# EAGLE design 100tqfpBreakout (EAGLE 6.6.0)
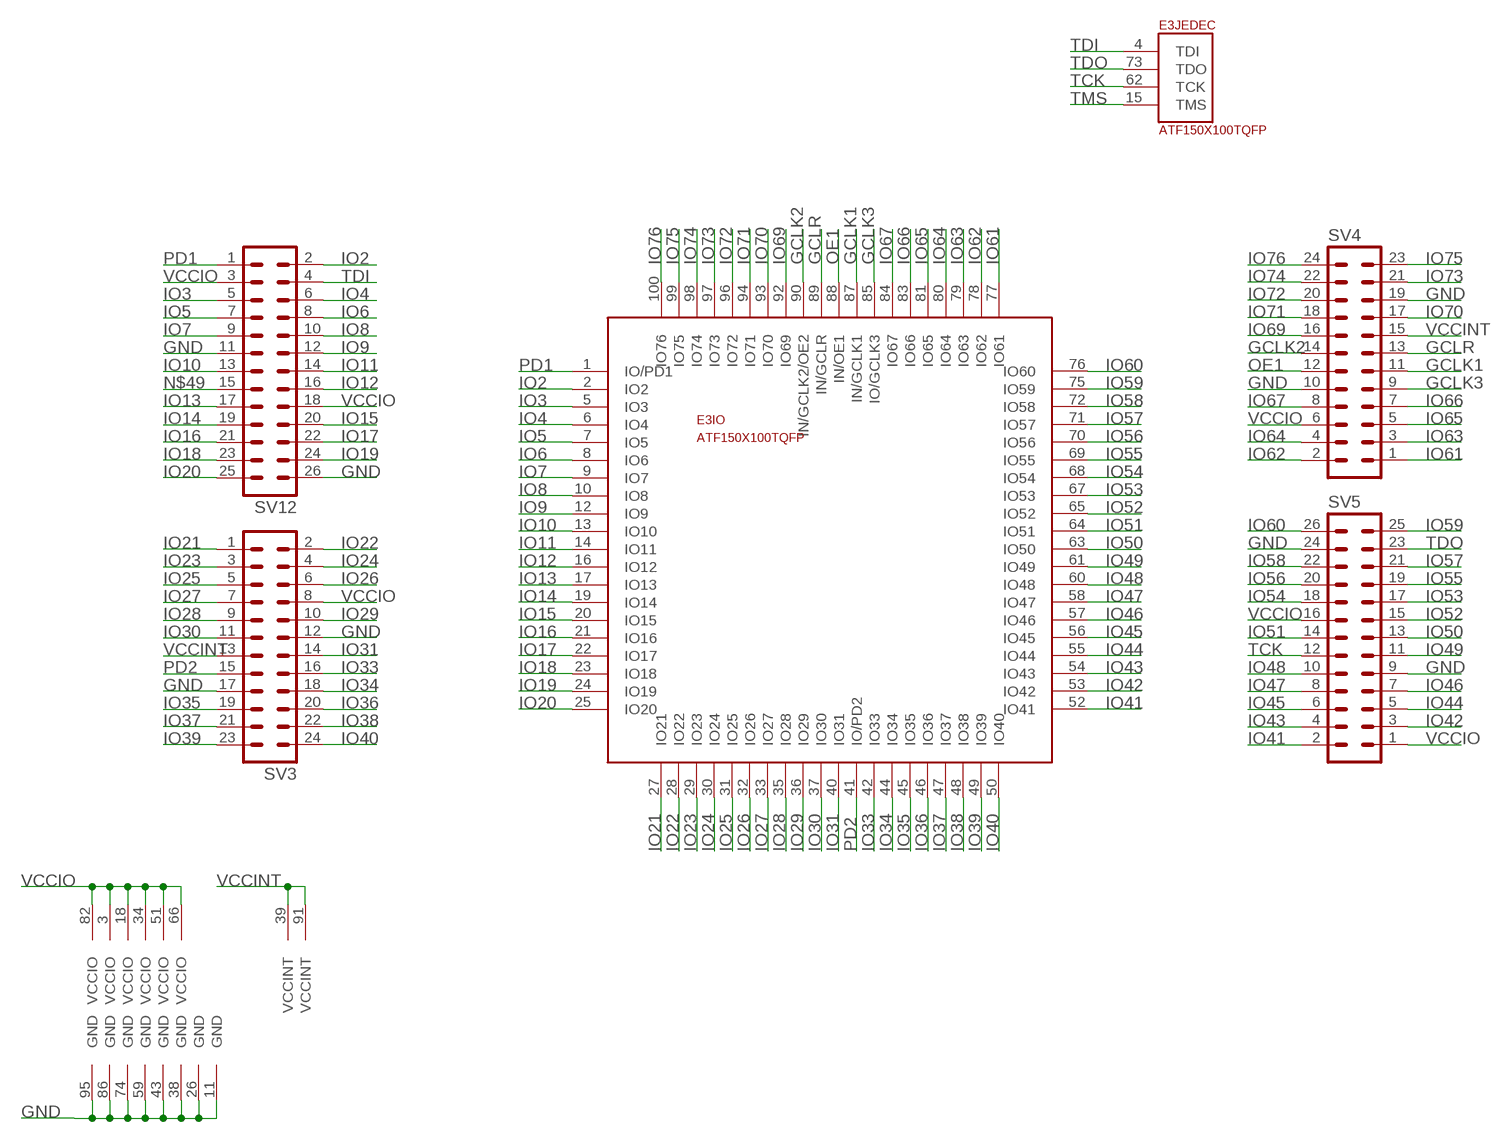
[diagram p0: schematic, sheet 1]

## Parts
E3  ATF150X100TQFP  [TQFP-100]
SV3  MA12-2  [MA12-2]
SV4  MA12-2  [MA12-2]
SV5  MA13-2  [MA13-2]
SV12  MA13-2  [MA13-2]

## Nets
GCLK1: E3.87(IO:IN/GCLK1) SV4.11
GCLK2: E3.90(IO:IN/GCLK2/OE2) SV4.14
GCLK3: E3.85(IO:IO/GCLK3) SV4.9
GCLR: E3.89(IO:IN/GCLR) SV4.13
GND: E3.11(GND) E3.26(GND) E3.38(GND) E3.43(GND) E3.59(GND) E3.74(GND) E3.86(GND) E3.95(GND) SV3.12 SV3.17 SV4.10 SV4.19 SV5.9 SV5.24 SV12.11 SV12.26
IO2: E3.2(IO:IO2) SV12.2
IO3: E3.5(IO:IO3) SV12.5
IO4: E3.6(IO:IO4) SV12.6
IO5: E3.7(IO:IO5) SV12.7
IO6: E3.8(IO:IO6) SV12.8
IO7: E3.9(IO:IO7) SV12.9
IO8: E3.10(IO:IO8) SV12.10
IO9: E3.12(IO:IO9) SV12.12
IO10: E3.13(IO:IO10) SV12.13
IO11: E3.14(IO:IO11) SV12.14
IO12: E3.16(IO:IO12) SV12.16
IO13: E3.17(IO:IO13) SV12.17
IO14: E3.19(IO:IO14) SV12.19
IO15: E3.20(IO:IO15) SV12.20
IO16: E3.21(IO:IO16) SV12.21
IO17: E3.22(IO:IO17) SV12.22
IO18: E3.23(IO:IO18) SV12.23
IO19: E3.24(IO:IO19) SV12.24
IO20: E3.25(IO:IO20) SV12.25
IO21: E3.27(IO:IO21) SV3.1
IO22: E3.28(IO:IO22) SV3.2
IO23: E3.29(IO:IO23) SV3.3
IO24: E3.30(IO:IO24) SV3.4
IO25: E3.31(IO:IO25) SV3.5
IO26: E3.32(IO:IO26) SV3.6
IO27: E3.33(IO:IO27) SV3.7
IO28: E3.35(IO:IO28) SV3.9
IO29: E3.36(IO:IO29) SV3.10
IO30: E3.37(IO:IO30) SV3.11
IO31: E3.40(IO:IO31) SV3.14
IO33: E3.42(IO:IO33) SV3.16
IO34: E3.44(IO:IO34) SV3.18
IO35: E3.45(IO:IO35) SV3.19
IO36: E3.46(IO:IO36) SV3.20
IO37: E3.47(IO:IO37) SV3.21
IO38: E3.48(IO:IO38) SV3.22
IO39: E3.49(IO:IO39) SV3.23
IO40: E3.50(IO:IO40) SV3.24
IO41: E3.52(IO:IO41) SV5.2
IO42: E3.53(IO:IO42) SV5.3
IO43: E3.54(IO:IO43) SV5.4
IO44: E3.55(IO:IO44) SV5.5
IO45: E3.56(IO:IO45) SV5.6
IO46: E3.57(IO:IO46) SV5.7
IO47: E3.58(IO:IO47) SV5.8
IO48: E3.60(IO:IO48) SV5.10
IO49: E3.61(IO:IO49) SV5.11
IO50: E3.63(IO:IO50) SV5.13
IO51: E3.64(IO:IO51) SV5.14
IO52: E3.65(IO:IO52) SV5.15
IO53: E3.67(IO:IO53) SV5.17
IO54: E3.68(IO:IO54) SV5.18
IO55: E3.69(IO:IO55) SV5.19
IO56: E3.70(IO:IO56) SV5.20
IO57: E3.71(IO:IO57) SV5.21
IO58: E3.72(IO:IO58) SV5.22
IO59: E3.75(IO:IO59) SV5.25
IO60: E3.76(IO:IO60) SV5.26
IO61: E3.77(IO:IO61) SV4.1
IO62: E3.78(IO:IO62) SV4.2
IO63: E3.79(IO:IO63) SV4.3
IO64: E3.80(IO:IO64) SV4.4
IO65: E3.81(IO:IO65) SV4.5
IO66: E3.83(IO:IO66) SV4.7
IO67: E3.84(IO:IO67) SV4.8
IO69: E3.92(IO:IO69) SV4.16
IO70: E3.93(IO:IO70) SV4.17
IO71: E3.94(IO:IO71) SV4.18
IO72: E3.96(IO:IO72) SV4.20
IO73: E3.97(IO:IO73) SV4.21
IO74: E3.98(IO:IO74) SV4.22
IO75: E3.99(IO:IO75) SV4.23
IO76: E3.100(IO:IO76) SV4.24
N$49: SV12.15
OE1: E3.88(IO:IN/OE1) SV4.12
PD1: E3.1(IO:IO/PD1) SV12.1
PD2: E3.41(IO:IO/PD2) SV3.15
TCK: E3.62(JEDEC:TCK) SV5.12
TDI: E3.4(JEDEC:TDI) SV12.4
TDO: E3.73(JEDEC:TDO) SV5.23
TMS: E3.15(JEDEC:TMS)
VCCINT: E3.39(VCCINT) E3.91(VCCINT) SV3.13 SV4.15
VCCIO: E3.3(VCCIO) E3.18(VCCIO) E3.34(VCCIO) E3.51(VCCIO) E3.66(VCCIO) E3.82(VCCIO) SV3.8 SV4.6 SV5.1 SV5.16 SV12.3 SV12.18

## Library data of the parts
E3 = atmel-cpld:ATF150X100: ATF150x in 100 pin package.
SV3 SV4 = con-lstb:MA12-2: PIN HEADER; OC_FARNELL: unknown; OC_NEWARK: unknown
SV5 SV12 = con-lstb:MA13-2: PIN HEADER; OC_FARNELL: unknown; OC_NEWARK: unknown

## Board
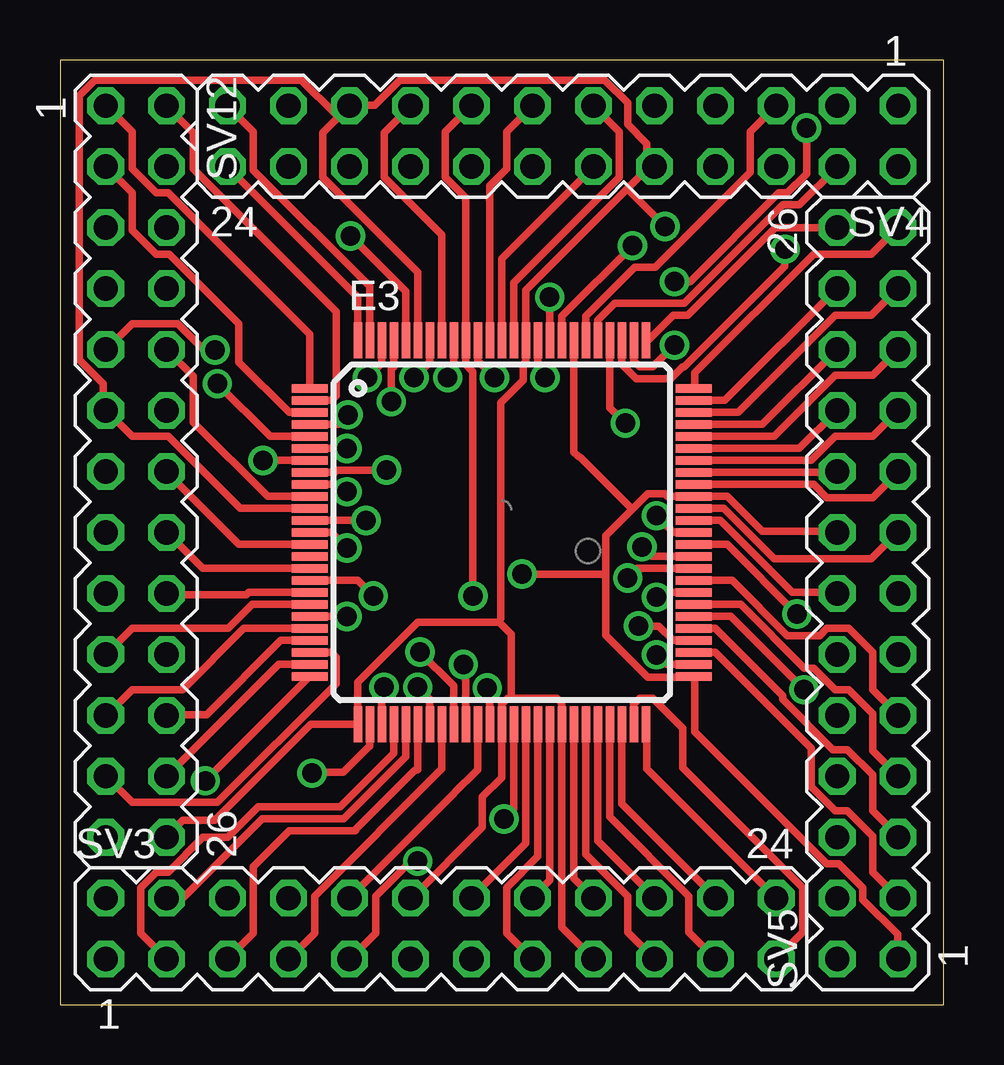
[diagram p1: board, top side]
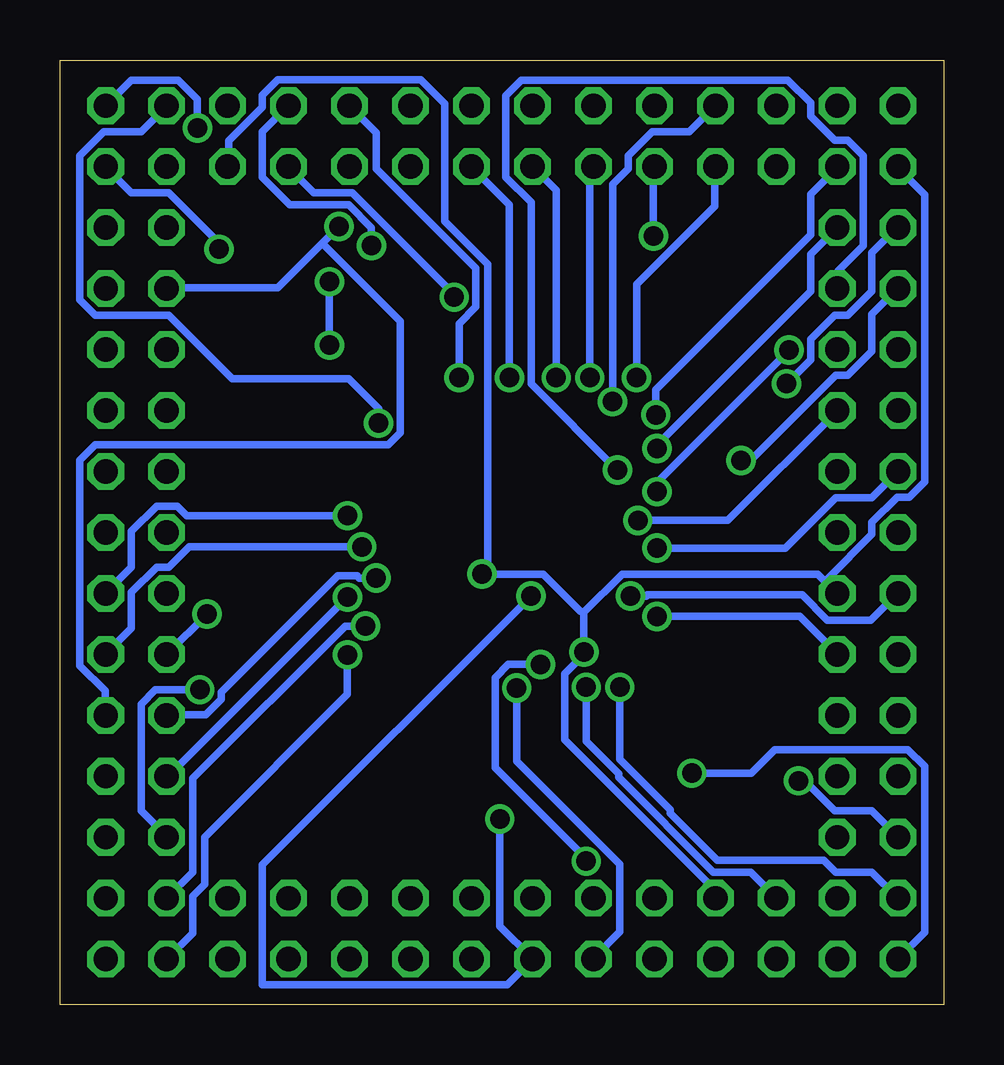
[diagram p2: board, bottom side, seen from below]

Size 36.83 x 39.37 mm. Coordinates in mm from the lower left corner, seen from the top.
Outline: 0,0 36.83,0 36.83,39.37 0,39.37 0,0
Copper layers (1*16): Top 0.035mm / dielectric 1.5mm / Bottom 0.035mm
Design rules "default *": minimum track width 12mil, minimum drill 32mil, track to track 6mil, track to pad 6mil, pad to pad 5mil, via to via 6mil, smd to smd 5mil, copper to edge 15mil, drill to drill 8mil, minimum pad ring 10mil, minimum via ring 8mil, stop-mask expansion 4mil, vias tented up to drill 32mil, thermal gap 10mil

### Footprints (pad centres in the part's own frame; a part is rotated, then mirrored left to right if it is on the bottom)
TQFP-100 = smd 1.5 x 0.35: 1 -8,6; 2 -8,5.5; 3 -8,5; 4 -8,4.5; 5 -8,4; 6 -8,3.5; 7 -8,3; 8 -8,2.5; 9 -8,2; 10 -8,1.5; 11 -8,1; 12 -8,0.5; 13 -8,0; 14 -8,-0.5; 15 -8,-1; 16 -8,-1.5; 17 -8,-2; 18 -8,-2.5; 19 -8,-3; 20 -8,-3.5; 21 -8,-4; 22 -8,-4.5; 23 -8,-5; 24 -8,-5.5; 25 -8,-6; 51 8,-6; 52 8,-5.5; 53 8,-5; 54 8,-4.5; 55 8,-4; 56 8,-3.5; 57 8,-3; 58 8,-2.5; 59 8,-2; 60 8,-1.5; 61 8,-1; 62 8,-0.5; 63 8,0; 64 8,0.5; 65 8,1; 66 8,1.5; 67 8,2; 68 8,2.5; 69 8,3; 70 8,3.5; 71 8,4; 72 8,4.5; 73 8,5; 74 8,5.5; 75 8,6 | smd 0.35 x 1.5: 26 -6,-8; 27 -5.5,-8; 28 -5,-8; 29 -4.5,-8; 30 -4,-8; 31 -3.5,-8; 32 -3,-8; 33 -2.5,-8; 34 -2,-8; 35 -1.5,-8; 36 -1,-8; 37 -0.5,-8; 38 0,-8; 39 0.5,-8; 40 1,-8; 41 1.5,-8; 42 2,-8; 43 2.5,-8; 44 3,-8; 45 3.5,-8; 46 4,-8; 47 4.5,-8; 48 5,-8; 49 5.5,-8; 50 6,-8; 76 6,8; 77 5.5,8; 78 5,8; 79 4.5,8; 80 4,8; 81 3.5,8; 82 3,8; 83 2.5,8; 84 2,8; 85 1.5,8; 86 1,8; 87 0.5,8; 88 0,8; 89 -0.5,8; 90 -1,8; 91 -1.5,8; 92 -2,8; 93 -2.5,8; 94 -3,8; 95 -3.5,8; 96 -4,8; 97 -4.5,8; 98 -5,8; 99 -5.5,8; 100 -6,8
MA12-2 = drill 1.016 octagon: 1 -13.97,-1.27; 2 -13.97,1.27; 3 -11.43,-1.27; 4 -11.43,1.27; 5 -8.89,-1.27; 6 -8.89,1.27; 7 -6.35,-1.27; 8 -6.35,1.27; 9 -3.81,-1.27; 10 -3.81,1.27; 11 -1.27,-1.27; 12 -1.27,1.27; 13 1.27,-1.27; 14 1.27,1.27; 15 3.81,-1.27; 16 3.81,1.27; 17 6.35,-1.27; 18 6.35,1.27; 19 8.89,-1.27; 20 8.89,1.27; 21 11.43,-1.27; 22 11.43,1.27; 23 13.97,-1.27; 24 13.97,1.27
MA13-2 = drill 1.016 octagon: 1 -15.24,-1.27; 2 -15.24,1.27; 3 -12.7,-1.27; 4 -12.7,1.27; 5 -10.16,-1.27; 6 -10.16,1.27; 7 -7.62,-1.27; 8 -7.62,1.27; 9 -5.08,-1.27; 10 -5.08,1.27; 11 -2.54,-1.27; 12 -2.54,1.27; 13 0,-1.27; 14 0,1.27; 15 2.54,-1.27; 16 2.54,1.27; 17 5.08,-1.27; 18 5.08,1.27; 19 7.62,-1.27; 20 7.62,1.27; 21 10.16,-1.27; 22 10.16,1.27; 23 12.7,-1.27; 24 12.7,1.27; 25 15.24,-1.27; 26 15.24,1.27

### Placement (x,y rotation side)
E3  18.41,19.68 0 top
SV3  15.88,3.17 0 top
SV4  20.95,36.2 180 top
SV5  33.66,17.14 90 top
SV12  3.17,22.23 270 top

### Tracks (layer width: path | path; a pad name or v marks a point on that pad's centre or on a via)
GCLK1
  Top 0.305: E3.87 18.91,27.73 18.91,30.09 23.3,34.48 23.3,36.38 22.25,37.44 SV4.11
GCLK2  (via drill 0.81)
  Top 0.305: v18.11,26.14 17.41,26.84 E3.90
  Bottom 0.305: v18.11,26.14 18.11,33.34 19.66,34.88 SV4.14
GCLK3  (via drill 0.81)
  Top 0.305: v20.2,26.14 19.91,26.43 E3.85
  Bottom 0.305: v20.2,26.14 20.2,28.39 19.5,29.09 19.5,30.68 23.66,34.84 23.66,36.34 24.75,37.44 SV4.9
GCLR
  Top 0.305: E3.89 17.91,27.73 17.91,34.13 18.61,34.84 18.61,36.38 19.66,37.44 SV4.13
GND  (via drill 0.81)
  Top 0.305: SV12.26 4.46,7.04 5.11,7.68 6.46,7.68 10.46,11.69 E3.26 12.4,11.84 12.4,13.44 14.9,15.94 18.3,15.94 | 18.8,12.79 20.7,12.79 20.91,12.59 20.91,11.73 E3.43 20.91,11.54 20.91,3.23 22.2,1.94 SV3.17 | 18.8,12.79 18.66,12.79 18.41,12.54 18.41,11.73 E3.38 18.4,11.55 18.4,9.46 17.6,8.66 17.6,7.4 14.65,4.45 SV3.12 | 18.3,15.94 18.8,15.44 18.8,12.94 18.8,12.79 | E3.11 7.5,20.68 4.5,23.68 3,23.68 1.96,24.73 SV12.11 1.8,24.89 1.8,25.89 0.81,26.89 0.81,37.88 1.46,38.53 10.05,38.53 11.51,37.09 SV4.19 | E3.95 14.9,27.73 14.9,30.54 10.96,34.48 10.96,36.34 12.05,37.44 SV4.19 | E3.59 26.45,17.68 28,17.68 30.3,15.38 31.66,15.38 31.95,15.69 32.85,15.69 33.85,14.69 33.85,13.13 34.91,12.09 SV5.9 | E3.74 26.45,25.18 27.7,25.18 32.35,29.84 SV5.24 | 23.63,34.01 24.5,34.88 24.75,34.88 SV4.10 24.45,35.03 24.45,35.88 23.66,36.69 23.66,37.59 22.7,38.53 14.15,38.53 13.11,37.48 12.21,37.48 SV4.19 | 23.63,34.01 19.41,29.79 19.41,27.73 E3.86 19.41,27.54 19.41,26.79 19.3,26.68 19.3,26.04 18.36,25.09 18.36,16.09 18.3,15.94 | v25.2,32.44 23.7,33.94 23.63,34.01
  Bottom 0.305: v25.2,32.44 25.91,31.73 | 25.91,31.73 27.75,29.89 32.35,29.89 SV5.24 | SV5.9 34.95,12.09 34.95,13.09 36.01,14.13 36.01,22.68 35.35,23.34 23.16,23.34 22.66,23.84 22.66,28.48 25.8,31.64 25.91,31.73
IO2
  Top 0.305: E3.2 10.46,25.18 11.3,25.18 11.51,25.39 11.51,28.89 5.55,34.84 5.55,36.34 4.46,37.44 SV12.2
IO3  (via drill 0.81)
  Top 0.305: v6.55,25.89 8.76,23.68 E3.5
  Bottom 0.305: v6.55,25.89 5.55,26.89 5.55,27.73 4.55,28.73 4,28.73 3,29.73 3,31.34 1.96,32.38 SV12.5
IO4  (via drill 0.81)
  Top 0.305: v11.96,23.18 10.46,23.18 E3.6
  Bottom 0.305: v11.96,23.18 11.96,23.34 5.55,29.73 5.55,31.29 SV12.6
IO5  (via drill 0.81)
  Top 0.305: v8.46,22.68 E3.7
  Bottom 0.305: v8.46,22.68 8.05,22.68 4.5,26.23 4,26.23 3,27.23 3,28.79 1.96,29.84 SV12.7
IO6  (via drill 0.81)
  Top 0.305: v13.61,22.29 11.55,22.29 11.46,22.18 10.46,22.18 E3.8
  Bottom 0.305: v13.61,22.29 17.2,25.89 17.2,33.44 18.25,34.48 18.25,37.88 17.61,38.53 6.5,38.53 5.55,37.59 5.55,37.03 4.55,36.03 4,36.03 3.35,35.38 3.35,31.64 4.41,30.59 4.41,29.89 SV12.8
IO7  (via drill 0.81)
  Top 0.305: v11.96,21.39 11.65,21.68 10.46,21.68 E3.9 | v6.46,27.29 6,27.29 4.91,28.39 3,28.39 1.96,27.34 SV12.9
  Bottom 0.305: v11.96,21.39 11.96,21.79 v6.46,27.29
IO8
  Top 0.305: E3.10 8.65,21.18 5.55,24.29 5.55,26.18 4.46,27.29 SV12.10
IO9  (via drill 0.81)
  Top 0.305: v12.76,20.18 10.46,20.18 E3.12
  Bottom 0.305: v12.76,20.18 9.01,20.18 4.46,24.73 SV12.12
IO10  (via drill 0.81)
  Top 0.305: v11.96,19.04 11.3,19.68 10.46,19.68 E3.13
  Bottom 0.305: v11.96,19.04 6.61,19.04 4.5,21.14 3,21.14 1.96,22.18 SV12.13
IO11
  Top 0.305: E3.14 7.46,19.18 4.46,22.18 SV12.14
IO12
  Top 0.305: E3.16 5.96,18.18 SV12.16
IO13  (via drill 0.81)
  Top 0.305: v13.05,17.04 12.4,17.68 10.46,17.68 E3.17
  Bottom 0.305: v13.05,17.04 12.4,17.04 12.36,17.09 5.91,17.09 4.86,16.04 3.06,16.04 1.96,17.14 SV12.17
IO14
  Top 0.305: E3.19 8.01,16.68 7,15.69 3,15.69 1.96,14.63 SV12.19
IO15  (via drill 0.81)
  Top 0.305: v11.96,16.18 10.46,16.18 E3.20
  Bottom 0.305: v11.96,16.18 6,16.18 4.46,14.63 SV12.20
IO16
  Top 0.305: E3.21 7.66,15.69 5.11,13.13 3,13.13 1.96,12.09 SV12.21
IO17
  Top 0.305: E3.22 9.21,15.19 6.11,12.09 4.46,12.09 SV12.22
IO18
  Top 0.305: E3.23 10.46,14.69 11.3,14.69 11.51,14.48 11.51,13.38 6.55,8.44 3,8.44 1.96,9.48 SV12.23
IO19
  Top 0.305: E3.24 9.11,14.19 SV12.24
IO20  (via drill 0.81)
  Top 0.305: v6.05,9.34 E3.25
  Bottom 0.305: v6.05,9.34 5.8,9.34 4.55,8.09 3,8.09 1.96,7.04 SV12.25
IO21  (via drill 0.81)
  Top 0.305: E3.27 12.9,10.79 12.8,10.69 11.8,9.69 10.51,9.69 v10.51,9.65
  Bottom 0.305: v10.51,9.65 8.04,9.65 7.05,10.63 1.5,10.63 0.81,9.94 0.81,3.04 1.91,1.94 SV3.1
IO22  (via drill 0.81)
  Top 0.305: v13.51,13.23 13.4,13.13 13.4,11.73 E3.28
  Bottom 0.305: v13.51,13.23 13.51,10.23 11.4,8.13 11.4,7.99 9.46,6.04 5,6.04 4.5,5.54 3,5.54 1.96,4.49 SV3.2
IO23
  Top 0.305: E3.29 13.9,10.48 11.68,8.26 8.26,8.26 6.99,6.99 5.96,6.99 4.5,5.54 4,5.54 3.35,4.88 3.35,2.98 4.41,1.94 SV3.3
IO24
  Top 0.305: E3.30 14.4,10.34 11.82,7.75 8.43,7.75 5.16,4.49 4.46,4.49 SV3.4
IO25
  Top 0.305: E3.31 14.9,9.8 14.76,9.76 12.36,7.36 12.3,7.25 9.55,7.25 8.05,5.75 8.05,2.98 7,1.94 SV3.5
IO26  (via drill 0.81)
  Top 0.305: v14.9,13.23 15.4,12.73 15.4,11.73 E3.32
  Bottom 0.305: v14.9,13.23 14.9,10.98 13.55,9.63 13.55,9.48 9.61,5.54 8.05,5.54 7,4.49 SV3.6
IO27
  Top 0.305: E3.33 15.9,9.84 10.61,4.54 10.61,2.98 9.55,1.94 SV3.7
IO28  (via drill 0.81)
  Top 0.305: v16.8,14.19 16.91,14.09 16.91,11.73 E3.35 | v14.9,5.99 14.61,5.99 13.15,4.54 13.15,2.98 12.11,1.94 SV3.9
  Bottom 0.305: v16.8,14.19 18.16,14.19 18.7,13.63 18.7,9.88 14.9,6.08 v14.9,5.99
IO29
  Top 0.305: E3.36 17.41,9.79 17.3,9.7 16.5,8.9 16.4,8.8 SV3.10
IO30  (via drill 0.81)
  Top 0.305: v17.8,13.2 17.9,13.1 17.9,11.7 E3.37
  Bottom 0.305: v17.8,13.2 17.8,10.15 13.5,5.85 13.5,3.05 14.6,1.95 SV3.11
IO31
  Top 0.305: E3.40 19.41,6.74 17.16,4.49 SV3.14
IO33
  Top 0.305: E3.42 20.41,5.18 19.7,4.49 SV3.16
IO34
  Top 0.305: E3.44 21.41,5.29 22.2,4.49 SV3.18
IO35
  Top 0.305: E3.45 21.91,6.29 23.66,4.54 23.66,3.04 24.75,1.94 SV3.19
IO36
  Top 0.305: E3.46 22.41,6.83 24.75,4.49 SV3.20
IO37
  Top 0.305: E3.47 22.91,7.83 26.2,4.54 26.2,3.04 27.3,1.94 SV3.21
IO38
  Top 0.305: E3.48 23.41,8.38 27.3,4.49 SV3.22
IO39
  Top 0.305: E3.49 23.91,11.73 23.91,12.54 24.16,12.79 24.7,12.79 25.95,11.54 25.95,9.88 30.95,4.88 30.95,3.04 29.86,1.94 SV3.23
IO40
  Top 0.305: E3.50 24.45,11.69 24.45,9.84 29.8,4.49 SV3.24
IO41  (via drill 0.81)
  Top 0.305: v24.86,14.59 25.25,14.19 E3.52
  Bottom 0.305: v24.86,14.59 24.86,12.94 30.8,6.99 30.8,5.04 31.3,4.54 31.3,2.98 32.35,1.94 SV5.2
IO42
  Top 0.305: E3.53 26.45,14.69 27.3,14.69 31.3,10.69 31.3,9.09 32.3,8.09 32.8,8.09 33.85,7.04 33.85,5.54 34.91,4.49 SV5.3
IO43  (via drill 0.81)
  Top 0.305: v24.11,15.79 24.95,15.79 25.55,15.19 E3.54
  Bottom 0.305: v24.11,15.79 24.95,15.79 31.3,9.44 31.3,5.54 32.35,4.49 SV5.4
IO44
  Top 0.305: E3.55 26.45,15.69 27.3,15.69 30.11,12.88 30.11,12.73 32.2,10.63 32.8,10.63 33.85,9.59 33.85,8.09 34.91,7.04 SV5.5
IO45  (via drill 0.81)
  Top 0.305: v31,13.13 27.95,16.18 26.45,16.18 E3.56
  Bottom 0.305: v31,13.13 32.85,13.13 33.45,12.54 33.45,8.09 32.41,7.04 SV5.6
IO46
  Top 0.305: E3.57 26.45,16.68 28.36,16.68 31,14.04 31.41,14.04 32.3,13.13 32.85,13.13 33.85,12.13 33.85,10.59 34.91,9.54 SV5.7
IO47  (via drill 0.81)
  Top 0.305: v24.86,16.98 25.05,17.18 E3.58
  Bottom 0.305: v24.86,16.98 32.35,9.48 SV5.8
IO48  (via drill 0.81)
  Top 0.305: v23.66,17.79 24.05,18.18 E3.60
  Bottom 0.305: v23.66,17.79 24.36,17.79 24.45,17.89 25.25,17.89 30.11,13.04 30.11,12.73 30.75,12.09 32.35,12.09 SV5.10
IO49  (via drill 0.81)
  Top 0.305: v24.25,19.09 24.66,18.68 E3.61
  Bottom 0.305: v24.25,19.09 31.45,19.09 32.3,18.23 32.8,18.23 33.85,17.18 33.85,15.69 34.91,14.63 SV5.11
IO50  (via drill 0.81)
  Top 0.305: v24.86,20.39 25.55,19.68 E3.63
  Bottom 0.305: v24.86,20.39 31.55,20.39 31.95,20.79 32.8,20.79 33.85,19.73 33.85,18.23 34.91,17.18 SV5.13
IO51
  Top 0.305: E3.64 26.45,20.18 27.5,20.18 30.5,17.18 32.35,17.18 SV5.14
IO52
  Top 0.305: E3.65 26.45,20.68 27.66,20.68 29.75,18.59 33.8,18.59 34.91,19.68 SV5.15
IO53
  Top 0.305: E3.67 26.45,21.68 31.41,21.68 31.95,21.14 33.85,21.14 34.91,22.18 SV5.17
IO54
  Top 0.305: E3.68 26.45,22.18 32.35,22.18 SV5.18
IO55
  Top 0.305: E3.69 26.45,22.68 31.3,22.68 32.3,23.68 33.85,23.68 34.91,24.73 SV5.19
IO56
  Top 0.305: E3.70 26.45,23.18 30.8,23.18 32.35,24.73 SV5.20
IO57
  Top 0.305: E3.71 26.45,23.68 29.75,23.68 32.3,26.23 33.85,26.23 34.91,27.29 SV5.21
IO58
  Top 0.305: E3.72 26.45,24.18 29.25,24.18 32.35,27.29 SV5.22
IO59
  Top 0.305: E3.75 26.45,25.73 26.45,26.34 31.41,31.29 33.8,31.29 34.91,32.38 SV5.25
IO60
  Top 0.305: E3.76 24.45,27.73 24.55,27.73 25.55,28.73 26.16,28.73 29.8,32.38 32.35,32.38 SV5.26
IO61  (via drill 0.81)
  Top 0.305: v25.61,27.48 24.7,26.59 24.16,26.59 23.91,26.84 E3.77 | v25.61,30.14 26.25,30.14 29.95,33.84 30.3,33.84 31.11,34.63 v31.11,36.53
  Bottom 0.305: v25.61,30.14 v25.61,27.48 | v31.11,36.53 31.11,37.73 31.91,38.53 33.85,38.53 34.91,37.48 SV4.1
IO62  (via drill 0.81)
  Top 0.305: v30.2,31.48 30.2,30.79 26,26.59 25.95,26.59 25.45,26.09 24,26.09 23.41,26.68 E3.78
  Bottom 0.305: v30.2,31.48 30.2,31.73 32.3,33.84 33.85,33.84 34.91,34.88 SV4.2
IO63  (via drill 0.81)
  Top 0.305: v23.55,24.23 22.91,24.89 E3.79
  Bottom 0.305: v23.55,24.23 23.55,24.84 24.8,26.09 29.66,26.09 32.3,28.73 35.35,28.73 36.01,29.39 36.01,35.38 35.01,36.38 33.45,36.38 32.41,37.44 SV4.3
IO64
  Top 0.305: E3.80 22.41,27.73 22.41,28.54 23.11,29.23 26,29.23 30.11,33.34 30.8,33.34 32.35,34.88 SV4.4
IO65
  Top 0.305: E3.81 21.91,27.73 21.91,28.68 23.95,30.73 24.8,30.73 28.75,34.69 28.75,36.38 29.8,37.44 SV4.5
IO66  (via drill 0.81)
  Top 0.305: v23.86,31.64 20.91,28.68 20.91,27.73 E3.83
  Bottom 0.305: v23.86,31.64 23.86,32.38 24.8,33.34 27.25,33.34 28.41,34.48 28.41,36.38 27.36,37.44 SV4.7
IO67  (via drill 0.81)
  Top 0.305: v20.41,29.48 20.41,27.73 E3.84
  Bottom 0.305: v20.41,29.48 20.41,29.59 24.66,33.84 26.25,33.84 27.3,34.88 SV4.8
IO69  (via drill 0.81)
  Top 0.305: v16.16,26.14 16.41,26.39 E3.92
  Bottom 0.305: v16.16,26.14 16.16,33.94 17.11,34.88 SV4.16
IO70
  Top 0.305: E3.93 15.9,27.73 15.9,32.09 13.51,34.48 13.51,36.34 14.61,37.44 SV4.17
IO71  (via drill 0.81)
  Top 0.305: v14.76,26.14 15.4,26.79 E3.94
  Bottom 0.305: v14.76,26.14 14.76,34.78 14.65,34.88 SV4.18
IO72  (via drill 0.81)
  Top 0.305: v12.11,32.03 14.4,29.73 14.4,27.73 E3.96
  Bottom 0.305: v12.11,32.03 12.11,34.88 SV4.20
IO73  (via drill 0.81)
  Top 0.305: v13.8,25.14 13.8,26.48 13.9,26.59 E3.97
  Bottom 0.305: v13.8,25.14 13.8,34.19 13.15,34.84 13.15,35.38 12.15,36.38 10.61,36.38 9.55,37.44 SV4.21
IO74  (via drill 0.81)
  Top 0.305: v12.8,26.14 13.4,26.73 E3.98
  Bottom 0.305: v12.8,26.14 12.8,30.04 9.55,33.28 9.55,34.88 SV4.22
IO75
  Top 0.305: E3.99 12.9,27.73 12.9,29.93 8.05,34.78 8.05,36.38 7,37.44 SV4.23
IO76
  Top 0.305: E3.100 12.4,27.73 12.4,29.48 7,34.88 SV4.24
OE1
  Top 0.305: E3.88 18.41,27.73 18.41,31.09 22.2,34.88 SV4.12
PD1
  Top 0.305: E3.1 10.4,25.73 10.4,27.93 4.5,33.84 4,33.84 3,34.84 3,36.38 1.96,37.44 SV12.1
PD2
  Top 0.305: E3.41 19.91,6.18 18.61,4.88 18.61,2.98 19.66,1.94 SV3.15
TCK  (via drill 0.81)
  Top 0.305: v30.7,16.29 27.8,19.18 26.45,19.18 E3.62
  Bottom 0.305: v30.7,16.29 32.35,14.63 SV5.12
TDI  (via drill 0.81)
  Top 0.305: v12.01,24.59 11.61,24.18 10.46,24.18 E3.4
  Bottom 0.305: v12.01,24.59 12.01,25.64 5.55,32.09 5.55,33.78 4.46,34.88 SV12.4
TDO
  Top 0.305: E3.73 26.45,24.68 28.25,24.68 32.3,28.73 33.8,28.73 34.91,29.84 SV5.23
VCCINT  (via drill 0.81)
  Top 0.305: SV4.15 17.11,37.44 16.05,36.38 16.05,34.48 16.91,33.63 16.91,27.73 E3.91 16.91,27.54 16.91,26.68 17.2,26.39 v17.2,17.04 | v18.5,7.75 18.91,8.15 E3.39
  Bottom 0.305: v18.5,7.75 18.5,3.29 17.16,1.94 SV3.13 17.16,1.89 18.2,0.83 28.41,0.83 28.41,5.83 v17.2,17.04
VCCIO  (via drill 0.81)
  Top 0.305: SV5.1 34.91,1.94 34.91,2.94 33.45,4.38 33.45,4.88 32.45,5.88 31.95,5.88 26.45,11.38 26.45,13.54 E3.51 26.3,13.65 24.5,13.65 22.75,15.4 22.75,17.95 | SV5.16 32.35,19.73 29.25,19.73 27.8,21.18 26.55,21.18 E3.66 26.3,21.2 25.3,21.2 25.2,21.3 24.5,21.3 23.85,20.65 | E3.18 7.86,17.18 7.75,17.09 4.5,17.09 4.46,17.14 SV12.18 | E3.3 9.55,24.68 7.46,26.79 7.46,28.39 4.55,31.29 4,31.29 3,32.28 3,33.84 1.96,34.88 SV12.3 | 23.85,20.65 22.75,19.55 22.75,17.95 | v15,14.7 16.4,13.3 16.4,11.7 E3.34 | v19.25,17.95 22.6,17.95 22.75,17.95 | E3.82 21.41,23.04 21.59,22.86 21.7,22.8 23.75,20.75 23.85,20.65
  Bottom 0.305: 15,16.35 v15,14.7 15.05,14.55 15.8,13.8 15.8,11.05 9.55,4.8 9.55,4.45 SV3.8 | 15,16.35 13.4,17.95 5.25,17.95 SV12.18 4.85,17.75 3,19.6 3,20.1 1.95,21.15 1.45,21.15 0.8,21.8 0.8,33.75 1.85,34.8 SV12.3 | 15,16.35 15.15,16.4 16.7,17.95 v19.25,17.95 19,18.1 19,30.85 20.8,32.65 20.8,37.55 21.8,38.55 27.75,38.55 28.4,37.9 28.4,37.4 29.8,36 29.8,34.95 SV4.6